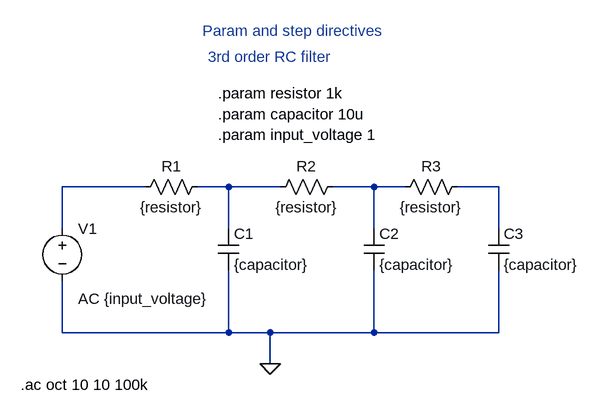
[diagram p0: schematic Parameter.asc]
Parameter.asc, the LTspice schematic file:
Version 4.1
SHEET 1 884 680
WIRE 192 80 64 80
WIRE 320 80 272 80
WIRE 400 80 320 80
WIRE 544 80 480 80
WIRE 592 80 544 80
WIRE 736 80 672 80
WIRE 64 144 64 80
WIRE 320 144 320 80
WIRE 544 144 544 80
WIRE 736 144 736 80
WIRE 64 304 64 224
WIRE 320 304 320 208
WIRE 320 304 64 304
WIRE 384 304 320 304
WIRE 544 304 544 208
WIRE 544 304 384 304
WIRE 736 304 736 208
WIRE 736 304 544 304
WIRE 384 352 384 304
FLAG 384 352 0
SYMBOL voltage 64 128 R0
WINDOW 123 24 124 Left 2
WINDOW 39 0 0 Left 0
SYMATTR InstName V1
SYMATTR Value ""
SYMATTR Value2 AC {input_voltage}
SYMBOL res 288 64 R90
WINDOW 0 0 56 VBottom 2
WINDOW 3 32 56 VTop 2
SYMATTR InstName R1
SYMATTR Value {resistor}
SYMBOL res 496 64 R90
WINDOW 0 0 56 VBottom 2
WINDOW 3 32 56 VTop 2
SYMATTR InstName R2
SYMATTR Value {resistor}
SYMBOL res 688 64 R90
WINDOW 0 0 56 VBottom 2
WINDOW 3 32 56 VTop 2
SYMATTR InstName R3
SYMATTR Value {resistor}
SYMBOL cap 304 144 R0
SYMATTR InstName C1
SYMATTR Value {capacitor}
SYMBOL cap 528 144 R0
SYMATTR InstName C2
SYMATTR Value {capacitor}
SYMBOL cap 720 144 R0
SYMATTR InstName C3
SYMATTR Value {capacitor}
TEXT 304 -64 Left 2 !.param resistor 1k
TEXT 304 -32 Left 2 !.param capacitor 10u
TEXT 0 384 Left 2 !.ac oct 10 10 100k
TEXT 304 0 Left 2 !.param input_voltage 1
TEXT 280 -160 Left 2 ;Param and step directives
TEXT 288 -120 Left 2 ;3rd order RC filter

The netlist it stands for:
* Parameter.asc
V1 N001 0 AC {input_voltage}
R1 N002 N001 {resistor}
R2 N003 N002 {resistor}
R3 N004 N003 {resistor}
C1 N002 0 {capacitor}
C2 N003 0 {capacitor}
C3 N004 0 {capacitor}
.param resistor 1k
.param capacitor 10u
.ac oct 10 10 100k
.param input_voltage 1
* Param and step directives
* 3rd order RC filter
.backanno
.end